# EAGLE design MyoWare_Power_Shield (EAGLE 7.5.0)
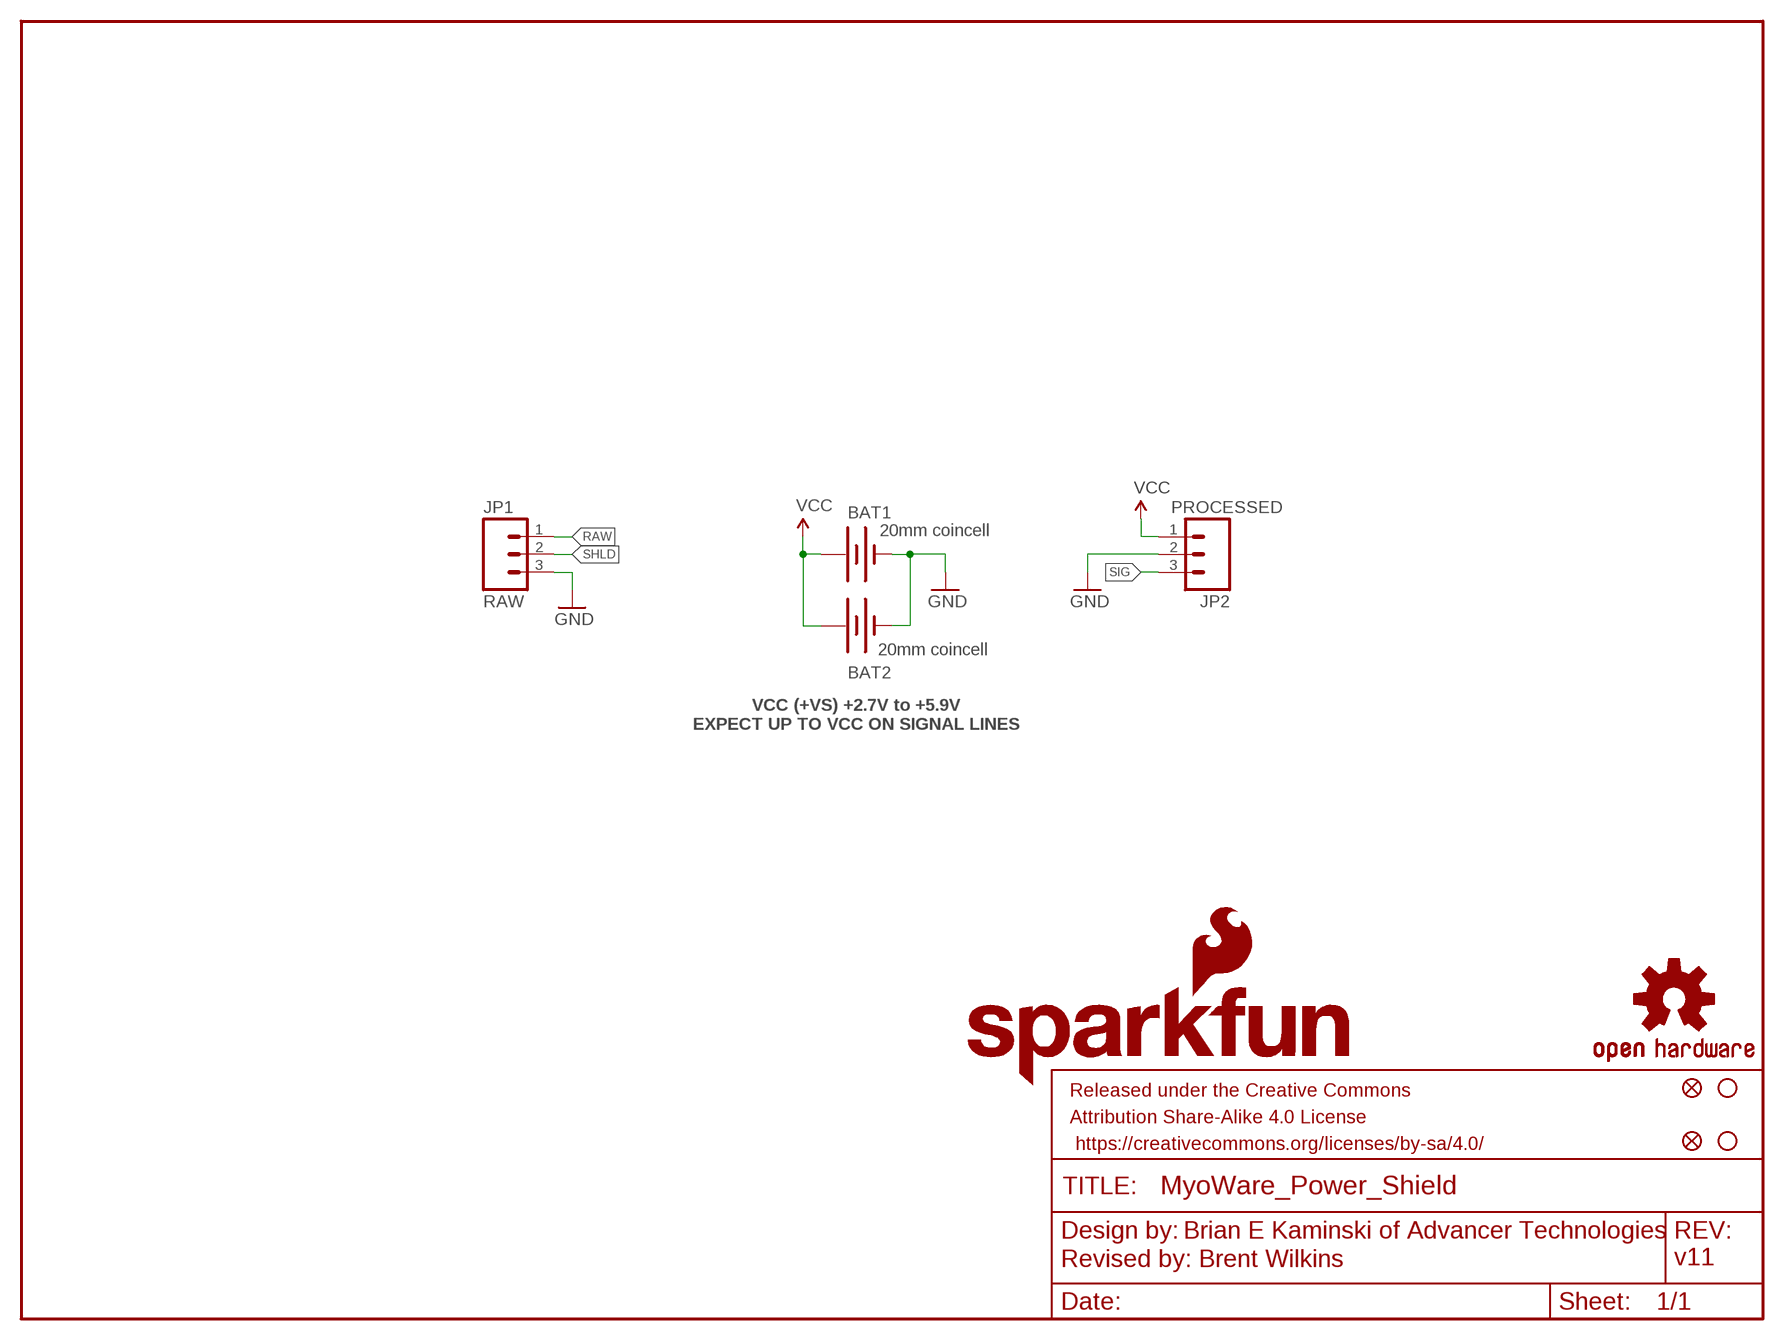
[diagram p0: schematic, sheet 1]

## Parts
BAT1  20mm coincell  BATTERY20MM_4LEGS  [BATTCON_20MM_4LEGS]
BAT2  20mm coincell  BATTERY20MM_4LEGS  [BATTCON_20MM_4LEGS]
FID1  FIDUCIAL1X2  [FIDUCIAL-1X2]
FID2  FIDUCIAL1X2  [FIDUCIAL-1X2]
FRAME1  FRAME-LETTER  [CREATIVE_COMMONS]
JP1  RAW  M03ALT_ORDER  [1X03_NO_SILK]
JP2  PROCESSED  M031X03_NO_SILK  [1X03_NO_SILK]
JP3  STAND-OFF  [STAND-OFF]
JP4  STAND-OFF  [STAND-OFF]
LOGO1  SFE_LOGO_NAME_FLAME.1_INCH  [SFE_LOGO_NAME_FLAME_.1]
LOGO2  OSHW-LOGOM  [OSHW-LOGO-M]

## Nets
GND: BAT1.2(-) BAT2.2(-) JP1.3 JP2.2
RAW: JP1.1
SHLD: JP1.2
SIG: JP2.3
VCC: BAT1.1(+) BAT2.1(+) JP2.1

## Notes on the sheet
- VCC (+VS) +2.7V to +5.9V
  EXPECT UP TO VCC ON SIGNAL LINES
- Brian E Kaminski of Advancer Technologies
- Revised by: Brent Wilkins | v11

## Library data of the parts
BAT1 BAT2 = SparkFun-Electromechanical:BATTERY: Battery Holders Various common sizes : AA, AAA, 18650 (PRT-12895), 20mm coin cell and 12mm coin cell. 20MM_4LEGS, BATT-10373; PROD_ID: BATT-10373
FID1 FID2 = SparkFun-Aesthetics:FIDUCIAL: Fiducial Alignment Points Various fiducial points for machine vision alignment.
FRAME1 = SparkFun-Aesthetics:FRAME-LETTER: Schematic Frame Standard 8.5x11 US Letter frame
JP1 JP2 = SparkFun-Connectors:M03: Header 3 Standard 3-pin 0.1" header. Use with straight break away headers (SKU : PRT-00116), right angle break away headers (PRT-00553), swiss pins (PRT-00743), machine pins (PRT-00117), and female headers (PRT-00115). Molex polarized connector foot print use with SKU : PRT-08232 with associated crimp pins and housings.
JP3 JP4 = SparkFunJan2012:STAND-OFF: Stand Off This is the mechanical footprint for a #4 phillips button head screw. Use the keepout ring to avoid running the screw head into surrounding components. SKU : PRT-00447
LOGO1 = SparkFun-Aesthetics:SFE_LOGO_NAME_FLAME: SFE Logo, name and flame This is the SparkFun full logo. The logo on the schematic will always be the same size; the package variant is the height of the flame part of the logo. Default layer for the logo on the board is tSilk.
LOGO2 = SparkFun-Aesthetics:OSHW-LOGO: Open Source Hardware Logo This logo indicates the piece of hardware it is found on incorporates a OSHW license and/or adheres to the definition of open source hardware found here: http://freedomdefined.org/OSHW

## Board
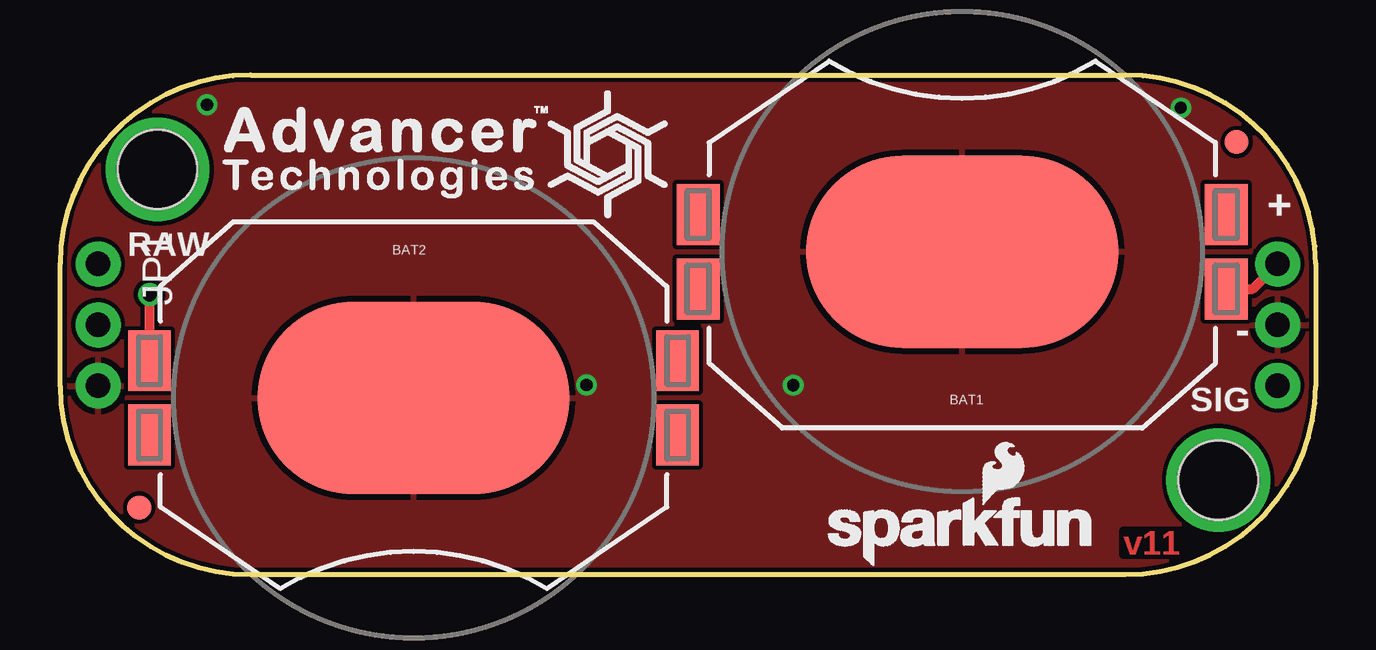
[diagram p1: board, top side]
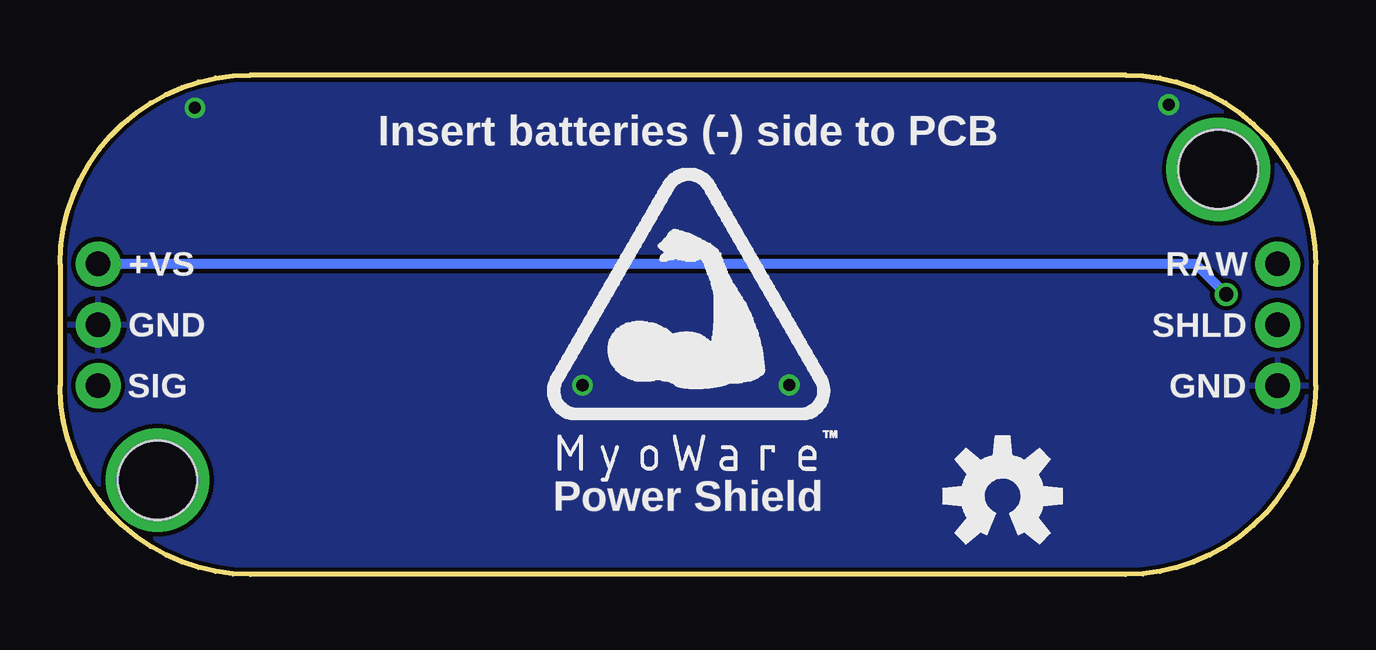
[diagram p2: board, bottom side, seen from below]

Size 52.32 x 20.83 mm. Coordinates in mm from the lower left corner, seen from the top.
Outline: 7.94,0 44.39,0 arc90 52.32,7.87 52.32,12.95 arc90 44.39,20.83 7.94,20.83 arc90 0,12.95 0,7.87 arc90 7.94,0
Copper layers (1*16): Top 0.035mm / dielectric 1.5mm / Bottom 0.035mm
Design rules "SparkFun-2-layer-TIGHT": minimum track width 7mil, minimum drill 15mil, track to track 7mil, track to pad 7mil, pad to pad 7mil, via to via 7mil, smd to smd 7mil, copper to edge 7mil, drill to drill 7mil, minimum pad ring 7mil, minimum via ring 7mil, stop-mask expansion 4mil, vias tented up to drill 25mil, thermal gap 10mil

### Footprints (pad centres in the part's own frame; a part is rotated, then mirrored left to right if it is on the bottom)
BATTCON_20MM_4LEGS = smd 1.778 x 2.54: 1 -11,1.55; 3 11,1.55; P$1 -11,-1.55; P$2 11,-1.55 | smd 13 x 8: 2 0,0
FIDUCIAL-1X2 = smd 1 x 1: 1 0,0
1X03_NO_SILK = drill 1.016 pad 1.88: 1 0,0; 2 2.54,0; 3 5.08,0
STAND-OFF = hole 3.302: 0,0

### Placement (x,y rotation side)
BAT1  37.59,13.46 180 top
BAT2  14.73,7.37 0 top
FID1  3.3,2.79 0 top
FID2  49.02,18.03 0 top
FRAME1  -6.08,-21.91 0 top  (outside the outline)
JP1  1.59,12.95 270 top
JP2  50.74,12.95 270 top
JP3  48.26,3.94 0 top
JP4  4.06,16.89 0 top
LOGO1  31.6,0.29 0 top
LOGO2  13.05,3.27 0 bottom
U$1  [MYOWARE_LOGO]  26.16,10.41 0 bottom
U$2  [ADVANCER_LOGO]  13.21,17.4 0 top
U$9  [SPIRAL_LOGO_60%]  22.86,17.53 0 top

### Tracks (layer width: path | path; a pad name or v marks a point on that pad's centre or on a via)
GND  (via drill 0.51)
  other vias: 21.94,7.91 6.13,19.59 46.7,19.46 30.55,7.9
  pour Top: 0,0 52.32,0 52.32,20.83 0,20.83
  pour Bottom: 0,0 52.32,0 52.32,20.83 0,20.83
N$3  (via drill 3.3)
  other vias: 4.06,16.89
N$4  (via drill 3.3)
  other vias: 48.26,3.94
VCC  (via drill 0.6)
  Top 0.406: BAT1.1 49.69,11.91 JP2.1 | BAT2.1 v3.73,11.68
  Bottom 0.406: v3.73,11.68 5,12.95 JP2.1

### Text on the board
Top: v11
tPlace: + | RAW | - | SIG
bPlace: Insert batteries (-) side to PCB | RAW | +VS | SHLD | GND | GND | SIG | Power Shield
Measures: All units in inches | 0.13" diameter typical
tDocu: Brian E Kaminski of Advancer Technologies | Revised by: Brent Wilkins